# Altium project XBEE_Pixhawk.PrjPcb
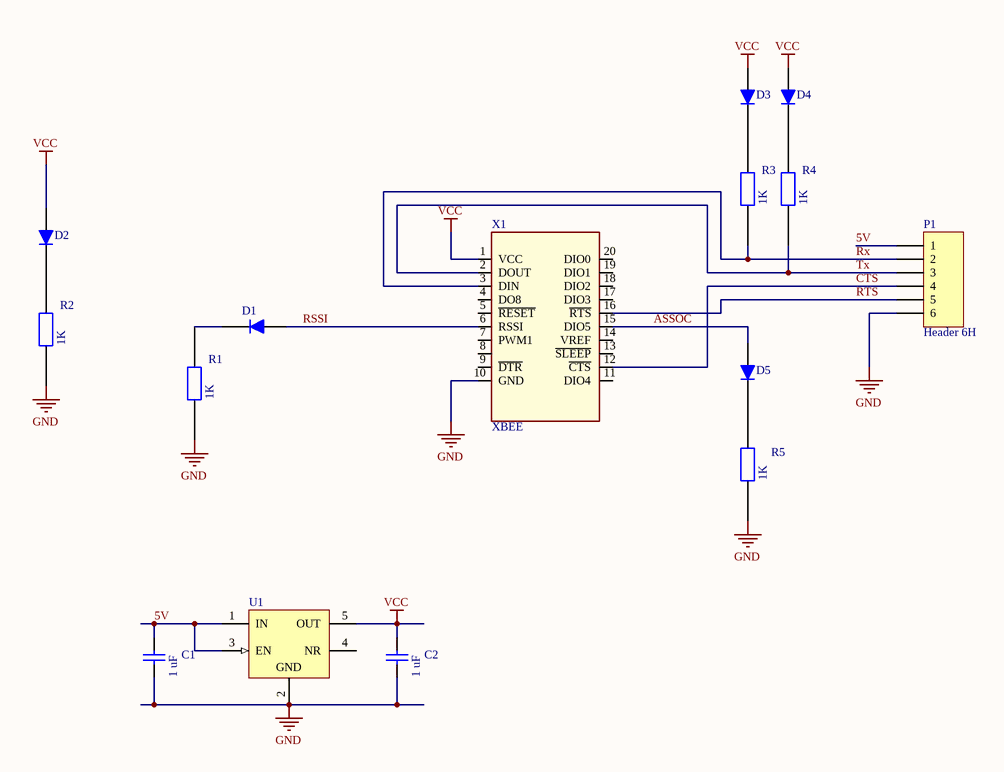
[diagram p0: Schematic.SchDoc]
1 sheet, 15 parts. Net scope: global (net labels, ports and power ports of the same name join across sheets).
Board file: PCB1.PcbDoc

## Sheet Schematic.SchDoc
size A4

### Parts
C1  GCM188R71C105KA64D  [CAPC1608]  (value not drawn)
C2  GCM188R71C105KA64D  [CAPC1608]  (value not drawn)
D1  LTST-C191KGKT  [LEDC1608M_AK]  (value not drawn)
D2  LTST-C191KGKT  [LEDC1608M_AK]  (value not drawn)
D3  LTST-C191KGKT  [LEDC1608M_AK]  (value not drawn)
D4  LTST-C191KGKT  [LEDC1608M_AK]  (value not drawn)
D5  LTST-C191KGKT  [LEDC1608M_AK]  (value not drawn)
P1  Header 6H  [DF13A-6P-1.25H]
R1  CR0603-FX-1001ELF  [RESC1608]  (value not drawn)
R2  CR0603-FX-1001ELF  [RESC1608]  (value not drawn)
R3  CR0603-FX-1001ELF  [RESC1608]  (value not drawn)
R4  CR0603-FX-1001ELF  [RESC1608]  (value not drawn)
R5  CR0603-FX-1001ELF  [RESC1608]  (value not drawn)
U1  V62/06626-05XE  [TI-DBV5_N]  (value not drawn)
X1  XBEE  [XBEE_PRO_ANT]

### Nets
GND: C1.1 C2.1 P1.6 R1.1 R2.1 R5.1 U1.2(GND) X1.10(GND)
VCC: C2.2 D2.A D3.A D4.A U1.5(OUT) X1.1(VCC)
5V: C1.2 P1.1 U1.1(IN) U1.3(EN)
ASSOC: D5.A X1.15(DIO5)
CTS: P1.4 X1.12(~{CTS})
RSSI: D1.A X1.6(RSSI)
RTS: P1.5 X1.16(~{RTS})
Rx: P1.2 R3.1 X1.3(DIN)
Tx: P1.3 R4.1 X1.2(DOUT)
NetD1_K: D1.K R1.2
NetD2_K: D2.K R2.2
NetD3_K: D3.K R3.2
NetD4_K: D4.K R4.2
NetD5_K: D5.K R5.2

Not connected (* = marked no-connect by the designer): U1 4(NR); X1 4(DO8) 5(~{RESET}) 7(PWM1) 8 9(~{DTR}) 11(DIO4) 13(~{SLEEP}) 14(VREF) 17(DIO3) 18(DIO2) 19(DIO1) 20(DIO0)

### Notes on the sheet
- (in symbol CR0603-FX-1001ELF) 1K

### Library data of the parts
C1 C2 = GCM188R71C105KA64D: Multilayer Ceramic Capacitors MLCC - SMD/SMT 0603 1.0uF 16volts X7R 10%; Manufacturer: Murata Electronics; Capacitance: 1 uF; Type: Automotive Ultra Small MLCC; Voltage Rating DC: 16 V; Supplier 1: Mouser; Manufacturer Part Number: GCM188R71C105KA64D; RoHS: RoHS Compliant; Category: Multilayer Ceramic Capacitors MLCC - SMD/SMT; Stock 1: 196143; Pricing 1: 1=0.432, 10=0.206, 100=0.122, 1000=0.114, 4000=0.080, 8000=0.077, 24000=0.074, 48000=0.069, 100000=0.061 (AUD); Height: 0.8 mm; Length: 1.6 mm; Package / Case: 0603 (1608 metric); Packaging: Reel; Product: Automotive MLCCs; Series: GCM; Termination Style: SMD/SMT; Tolerance: 10 %; Width: 0.8 mm; Brand: Murata Electronics; Case Code - in: 0603; Case Code - mm: 1608; Dielectric: X7R; Maximum Operating Temperature: + 125 C; Minimum Operating Temperature: - 55 C; Product Category: Automotive Ceramic Chip Capacitors; Standard Pack Qty: 4000; RoHS - Mouser: Y; Minimum Order Quantity: 1; Reeling: True; ComponentLink1URL: http://www.mouser.com/ds/2/281/c03e-516224.pdf; ComponentLink1Description: http://www.mouser.com/ds/2/281/c03e-516224.pdf; Supplier Part Number 1: 81-GCM188R71C105K64D
D1-D5 = LTST-C191KGKT: LED GREEN CLEAR 0603 SMD; Manufacturer: Lite-On Inc.; Wavelength - Dominant: 571nm; Wavelength - Peak: 574nm; Millicandela Rating: 35mcd; Voltage - Forward (Vf) (Typ): 2V; Current - Test: 20mA; Viewing Angle: 130°; Lens Color: Colorless; Lens Style/Size: Rectangle with Flat Top, 1.10mm x 0.80mm; Supplier 1: Digi-Key; Manufacturer Part Number: LTST-C191KGKT; RoHS: RoHS Compliant; Category: Optoelectronics; Stock 1: 654931; Pricing 1: 1=0.36, 10=0.284, 100=0.1549, 250=0.10328, 500=0.08778, 1000=0.06712, 2500=0.06067 (AUD); Packaging: Cut Tape (CT); Color: Green; Lens Transparency: Clear; Package / Case: 0603 (1608 Metric); Supplier Device Package: *; Size / Dimension: 1.60mm L x 0.80mm W; Height (Max): 0.55mm; Mounting Type: Surface Mount; ComponentLink1URL: http://optoelectronics.liteon.com/upload/download/DS22-2000-228/S_110_LTST-C191KGKT.pdf; ComponentLink1Description: http://optoelectronics.liteon.com/upload/download/DS22-2000-228/S_110_LTST-C191KGKT.pdf; Supplier Part Number 1: 160-1446-1-ND
P1 = Header 6H: Header, 6-Pin, Right Angle; LatestRevisionDate: 17-Jul-2002; LatestRevisionNote: Re-released for DXP Platform.; Publisher: Altium Limited
R1-R5 = CR0603-FX-1001ELF: RES SMD 1K OHM 1% 1/10W 0603; Manufacturer: Bourns Inc.; Power (Watts): 0.1W, 1/10W; Temperature Coefficient: ±100ppm/°C; Supplier 1: Digi-Key; Manufacturer Part Number: CR0603-FX-1001ELF; RoHS: RoHS Compliant; Category: Resistors; Stock 1: 28425; Pricing 1: 1=0.14, 10=0.065, 25=0.0472, 50=0.036, 100=0.0266, 250=0.02024, 500=0.01618, 1000=0.01193, 2500=0.01035 (AUD); Packaging: Digi-Reel®; Resistance (Ohms): 1k; Tolerance: ±1%; Composition: Thick Film; Features: Moisture Resistant; Operating Temperature: -55°C ~ 155°C; Package / Case: 0603 (1608 Metric); Supplier Device Package: 0603; Size / Dimension: 0.063" L x 0.031" W (1.60mm x 0.80mm); Height: 0.022" (0.55mm); Number of Terminations: 2; ComponentLink1URL: http://www.bourns.com/docs/Product-Datasheets/CHPREZTR.pdf; ComponentLink1Description: http://www.bourns.com/docs/Product-Datasheets/CHPREZTR.pdf; Supplier Part Number 1: CR0603-FX-1001ELFDKR-ND
U1 = V62/06626-05XE: Single Output LDO, 400 mA, Fixed 3 V Output, 1.7 to 5.5 V Input, with Reverse Current Protection, 5-pin SOT-23 (DBV), -55 to 125 degC, Green (RoHS & no Sb/Br); Manufacturer: Texas Instruments; Accuracy(%): 1; Fixed Output Options(V): 3; Iout(Max)(A): 0.4; Iq(Typ)(mA): 0.3; Rating: HiRel Enhanced Product; SubFamily: Single Channel LDO; Vdo(Typ)(mV): 75; Vin(Max)(V): 5.5; Vin(Min)(V): 1.7; DatasheetVersion: SGLS326C; PackageVersion: 4073253-4/K; PackageReference: DBV5; PackageDescription: 5-Pin Plastic Small Outline, Body 1.60 Ã— 2.90 mm, Pitch 0.95 mm; Supplier 1: Newark; Supplier Part Number 1: 46M1823; Supplier 2: Mouser; Supplier Part Number 2: 595-V62/06626-05XE; Eco-Plan: Green (RoHS & no Sb/Br); Vout Adj(Max)(V): 3; Vout Adj(Min)(V): 3; Mounting Technology: Surface Mount; Code_JEDEC: MO-178; PartNumber: V62/06626-05XE; ComponentLink1Description: Manufacturer URL; ComponentLink1URL: http://www.ti.com/; ComponentLink2Description: Datasheet; ComponentLink2URL: http://www.ti.com/general/docs/lit/getliterature.tsp?genericPartNumber=TPS73630-EP&fileType=pdf; ComponentLink3Description: Package Specification; ComponentLink3URL: http://www.ti.com/litv/pdf/mpds018i; ComponentLink4Description: URL Link1; ComponentLink4URL: Samples URL:http://www.ti.com/product/tps73630-ep#samples
X1 = XBEE: ID: XBP24-Z7UIT-004; PDF: http://ftp1.digi.com/support/documentation/90000982_M.pdf; BUY_LINK: http://www.digikey.com/product-detail/en/XBP24-Z7UIT-004/602-1101-ND/1942307; PRICE: 34